# Altium project slave board_Project.PrjPCB
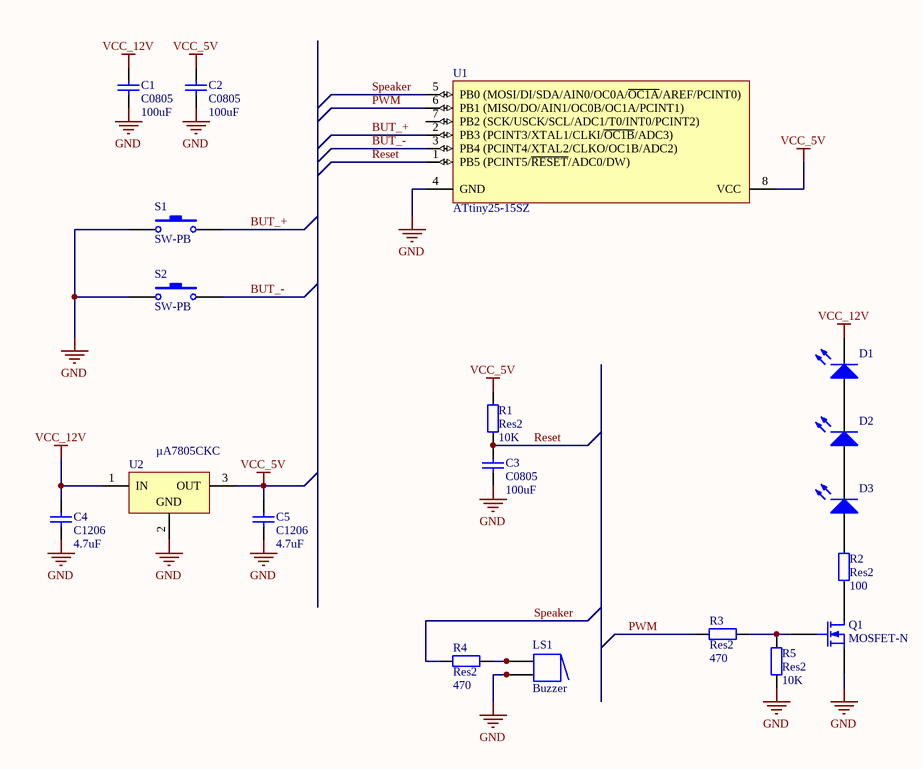
[diagram p0: slave board_CHM.SchDoc]
1 sheet, 19 parts. Net scope: global (net labels, ports and power ports of the same name join across sheets).
Board file: slave board_PCB.PcbDoc

## Sheet slave board_CHM.SchDoc
size A4

### Parts
C1  C0805  value 100uF  [0805]
C2  C0805  value 100uF  [0805]
C3  C0805  value 100uF  [0805]
C4  C1206  value 4.7uF  [1206]
C5  C1206  value 4.7uF  [1206]
D1  LED3  [3.5X2.8X1.9]  (value not drawn)
D2  LED3  [3.5X2.8X1.9]  (value not drawn)
D3  LED3  [3.5X2.8X1.9]  (value not drawn)
LS1  Buzzer  [ABSM-1574]
Q1  MOSFET-N  [E3]
R1  Res2  value 10K  [6-0805_M]
R2  Res2  value 100  [6-0805_M]
R3  Res2  value 470  [6-0805_M]
R4  Res2  value 470  [6-0805_M]
R5  Res2  value 10K  [6-0805_M]
S1  SW-PB  [SPST-2]
S2  SW-PB  [SPST-2]
U1  ATtiny25-15SZ  [T5_N]
U2  µA7805CKC  [KC03]

### Nets
GND: C1.1 C2.1 C3.1 C4.1 C5.1 LS1.2 LS1.2A Q1.3(S) R5.1 S1.1 S2.1 U1.4(GND) U2.2(GND)
VCC_5V: C2.2 C5.2 R1.2 U1.8(VCC) U2.3(OUT)
VCC_12V: C1.2 C4.2 D1.2(K) U2.1(IN)
BUT_+: S1.2 U1.2(PB3_(PCINT3/XTAL1/CLKI/~{OC1B}/ADC3))
BUT_-: S2.2 U1.3(PB4_(PCINT4/XTAL2/CLKO/OC1B/ADC2))
PWM: R3.1 U1.6(PB1_(MISO/DO/AIN1/OC0B/OC1A/PCINT1))
Reset: C3.2 R1.1 U1.1(PB5_(PCINT5/~{RESET}/ADC0/DW))
Speaker: R4.1 U1.5(PB0_(MOSI/DI/SDA/AIN0/OC0A/~{OC1A}/AREF/PCINT0))
NetD1_1: D1.1(A) D2.2(K)
NetD2_1: D2.1(A) D3.2(K)
NetD3_1: D3.1(A) R2.2
NetLS1_1: LS1.1 LS1.1A R4.2
NetQ1_1: Q1.1(D) R2.1
NetQ1_2: Q1.2(G) R3.2 R5.2

Not connected (* = marked no-connect by the designer): U1 7(PB2_(SCK/USCK/SCL/ADC1/T0/INT0/PCINT2))

### Library data of the parts
C1-C3 = C0805: Ceramic Chip Capacitor - Standard; Note: Footprint corresponds to dimensions for bulk cassette packaging. This case size has tightened tolerances.; Published: 17-Jul-2002; LatestRevisionDate: 19-Mar-2004; LatestRevisionNote: Silkscreen size reduced.; DatasheetDocument: Mar-2001; PackageDocument: Mar-2001; PackageReference: 0805; Publisher: Altium Limited; Code_JEITA: 0805; Code_IPC: 2012[0805]; ComponentLink1Description: Manufacturer Link; ComponentLink1URL: http://www.kemet.com/; ComponentLink2Description: Datasheet; ComponentLink2URL: http://www.kemet.com/kemet/web/homepage/kechome.nsf/vapubfilesname/F3102TA.pdf/$file/F3102TA.pdf
C4 C5 = C1206: Ceramic Chip Capacitor - Standard; Published: 17-Jul-2002; LatestRevisionDate: 19-Mar-2004; LatestRevisionNote: Silkscreen size reduced.; DatasheetDocument: Mar-2001; PackageDocument: Mar-2001; PackageReference: 1206; Publisher: Altium Limited; Code_JEITA: 1206; Code_IPC: 3216 [1206]; ComponentLink1Description: Manufacturer Link; ComponentLink1URL: http://www.kemet.com/; ComponentLink2Description: Datasheet; ComponentLink2URL: http://www.kemet.com/kemet/web/homepage/kechome.nsf/vapubfilesname/F3102TA.pdf/$file/F3102TA.pdf
D1-D3 = LED3: Typical BLUE SiC LED; Published: 8-Jun-2000; LatestRevisionDate: 17-Dec-2003; LatestRevisionNote: PCB Footprint replaced.; DatasheetVersion: 16-Apr-2002; PackageVersion: 16-Apr-2002; PackageReference: 3.5X2.8X1.9; Publisher: Altium Limited; PackageDescription: SM LED; 2 C-Bend Leads; Body 3.5 x 2.8 x 1.9 mm, inc leads (LxWxH typ)
LS1 = Buzzer: Magnetic Transducer Buzzer; Published: 24-Mar-1999; LatestRevisionDate: 17-Dec-2003; LatestRevisionNote: Schematic revised, PCB Footprint replaced.; DatasheetVersion: 17-Dec-2003; PackageReference: ABSM-1574; Publisher: Altium Limited; PackageDescription: Magnetic Transducer Buzzer; ComponentLink1Description: Manufacturer Link; ComponentLink1URL: http://www.megastar.com/linecard/buzzmode/index.php
Q1 = MOSFET-N: N-Channel MOSFET; Published: 8-Jun-2000; LatestRevisionDate: 17-Jul-2002; LatestRevisionNote: Re-released for DXP Platform.; PackageVersion: 1995/1996; PackageReference: E3; Publisher: Altium Limited; PackageDescription: TO, Flat Index; 3 In-Line, Axial Leads; Body Dia. 4.6mm; Lead Dia. 0.5 mm (max)
R1-R5 = Res2: Resistor; Published: 8-Jun-2000; LatestRevisionDate: 17-Jul-2002; LatestRevisionNote: Re-released for DXP Platform.; PackageReference: AXIAL-0.4; Publisher: Altium Limited; PackageDescription: Axial Device, Thru-Hole; 2 Leads; 0.4 in Pin Spacing
S1 S2 = SW-PB: Switch; Published: 24-Mar-1999; LatestRevisionDate: 17-Jul-2002; LatestRevisionNote: Re-released for DXP Platform.; PackageReference: SPST-2; Publisher: Altium Limited; PackageDescription: Switch; 2 Leads
U1 = ATtiny25-15SZ: 8-bit Automotive AVR Microcontroller, 2KB Flash, 128 Bytes EEPROM, 128 Bytes SRAM, Automotive Grade (-40°C to +125°C), 8-Pin SOIC; Published: 1-Apr-2010; DatasheetVersion: revH, Jul-2009; PackageVersion: 2009; PackageReference: T5; Publisher: Altium Limited; PackageDescription: 8-Lead, 0.208" Body, Plastic Small Outline Package; Supplier 1: Digi-Key; Supplier Part Number 1: ATTINY25-15SZ-ND; Supplier 2: Mouser; Supplier Part Number 2: 556-ATTINY25-15SZ; ComponentLink1Description: Manufacturer Link; ComponentLink1URL: http://www.atmel.com/products/avr/default.asp?; ComponentLink2Description: ATtiny25/45/85 Datasheet; ComponentLink2URL: http://www.atmel.com/dyn/resources/prod_documents/doc7598.pdf; ComponentLink3Description: Atmel.com Home; ComponentLink3URL: http://www.atmel.com
U2 = µA7805CKC: Positive-Voltage Regulator; Note: Pin 2 is electrically connected to TAB.; Published: 15-Apr-2002; DatasheetVersion: Jul-1999; PackageVersion: Sep-1995; PackageReference: KC03; Publisher: Altium Limited; PackageDescription: TO, Thru-Hole, Vertical, Heatsink Mounted; 3 In-Line Leads; Pitch 2.54 mm; ComponentLink1Description: Manufacturer Link; ComponentLink1URL: http://www.ti.com/; ComponentLink2Description: Datasheet; ComponentLink2URL: http://www-s.ti.com/sc/ds/ua7805.pdf